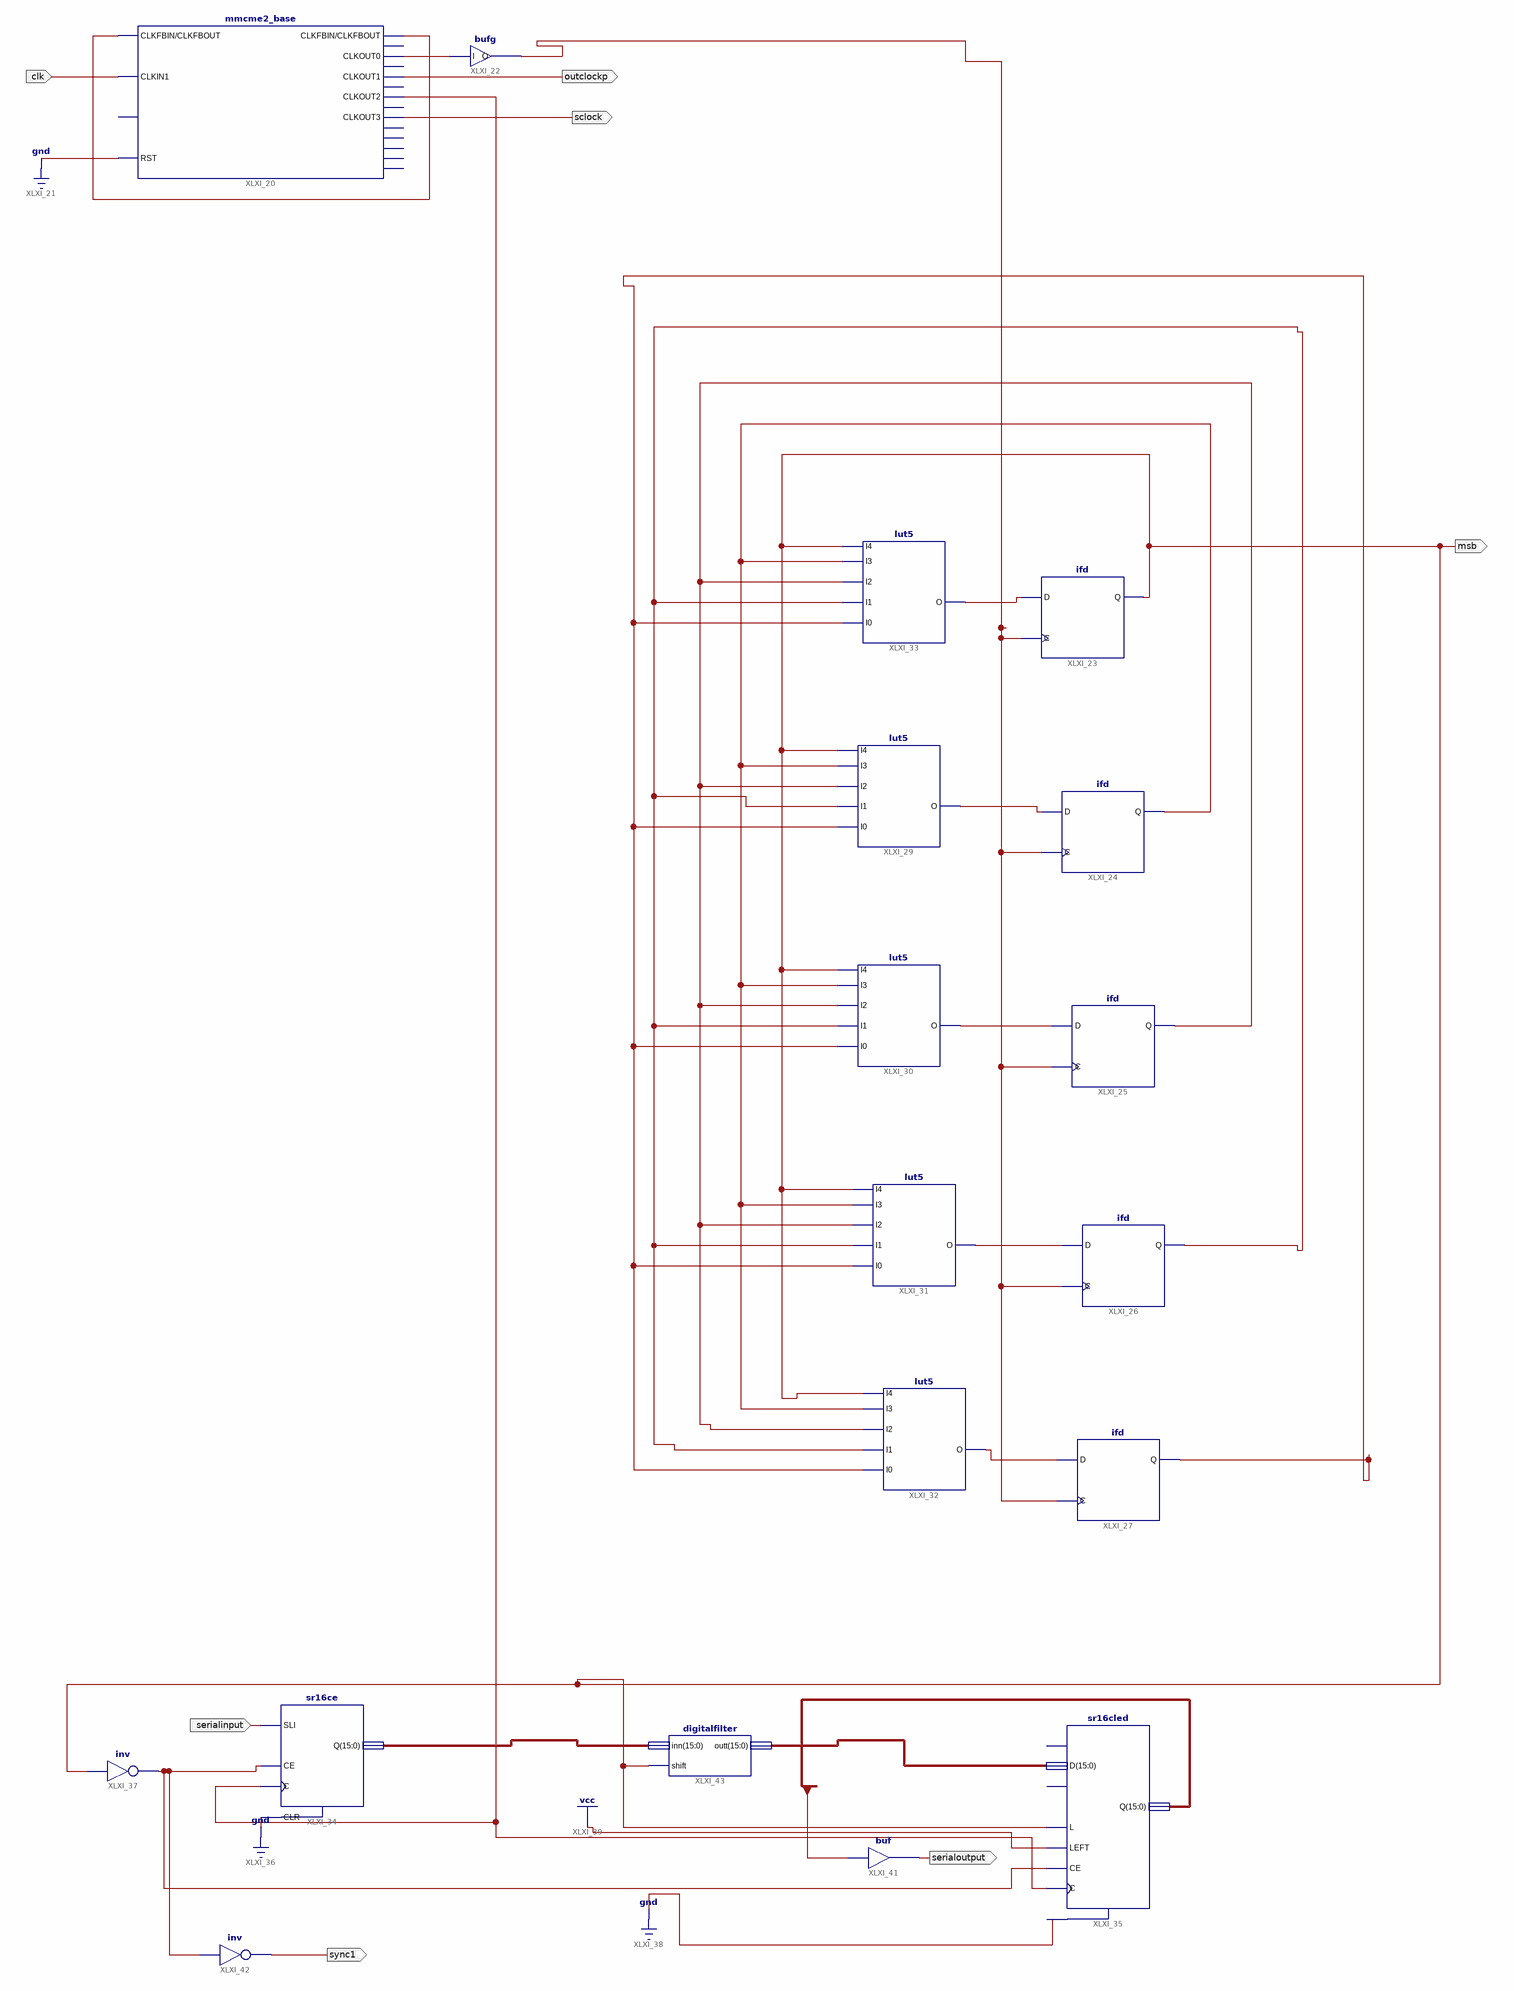
[diagram p0: schematic sheet 1]
// Xilinx ISE schematic timinggenerator.sch (artix7) as structural Verilog: 18 symbols, 7 ports
module timinggenerator (
  input  clk,
  input  serialinput,
  output outclockp,
  output msb,
  output serialoutput,
  output sclock,
  output sync1
);

  wire outclock, sync, XLXN_15, XLXN_19, XLXN_22, XLXN_23, XLXN_24, XLXN_25, XLXN_33, XLXN_36, XLXN_44,
       XLXN_48, XLXN_51, XLXN_54;
  wire [15:0] XLXN_69, XLXN_77, XLXN_79;

  mmcme2_base #(.CLKOUT0_DIVIDE_F(30), .CLKFBOUT_MULT_F(6.000), .CLKOUT1_PHASE(90), .CLKOUT1_DIVIDE(30), .CLKOUT2_PHASE(180), .CLKOUT2_DIVIDE(30), .CLKOUT3_PHASE(270), .CLKOUT3_DIVIDE(30)) XLXI_20 (
    .CLKFBIN(XLXN_15), .CLKIN1(clk), .RST(1'b0), .CLKFBOUT(XLXN_15), .CLKOUT0(XLXN_19), .CLKOUT1(outclockp),
    .CLKOUT2(XLXN_54), .CLKOUT3(sclock));  // open: PWRDWN, CLKFBOUTB, CLKOUT0B, CLKOUT1B, CLKOUT2B, CLKOUT3B, CLKOUT4, CLKOUT5, CLKOUT6, LOCKED
  bufg XLXI_22 (.I(XLXN_19), .O(outclock));
  ifd XLXI_23 (.C(outclock), .D(XLXN_51), .Q(msb));
  ifd XLXI_24 (.C(outclock), .D(XLXN_25), .Q(XLXN_33));
  ifd XLXI_25 (.C(outclock), .D(XLXN_24), .Q(XLXN_36));
  ifd XLXI_26 (.C(outclock), .D(XLXN_23), .Q(XLXN_48));
  lut5 #(.INIT("00007f80")) XLXI_29 (.I0(XLXN_44), .I1(XLXN_48), .I2(XLXN_36), .I3(XLXN_33), .O(XLXN_25), .I4(msb));
  lut5 #(.INIT("00007878")) XLXI_30 (.I0(XLXN_44), .I1(XLXN_48), .I2(XLXN_36), .I3(XLXN_33), .O(XLXN_24), .I4(msb));
  lut5 #(.INIT("00066666")) XLXI_31 (.I0(XLXN_44), .I1(XLXN_48), .I2(XLXN_36), .I3(XLXN_33), .O(XLXN_23), .I4(msb));
  lut5 #(.INIT("00055555")) XLXI_32 (.I0(XLXN_44), .I1(XLXN_48), .I2(XLXN_36), .I3(XLXN_33), .O(XLXN_22), .I4(msb));
  ifd XLXI_27 (.C(outclock), .D(XLXN_22), .Q(XLXN_44));
  lut5 #(.INIT("00078000")) XLXI_33 (.I0(XLXN_44), .I1(XLXN_48), .I2(XLXN_36), .I3(XLXN_33), .O(XLXN_51), .I4(msb));
  sr16ce XLXI_34 (.C(XLXN_54), .CE(sync), .CLR(1'b0), .SLI(serialinput), .Q(XLXN_77));
  sr16cled XLXI_35 (.C(XLXN_54), .CE(sync), .D(XLXN_79), .L(msb), .LEFT(1'b1), .Q(XLXN_69));  // open: CLR, SLI, SRI
  not XLXI_37 (sync, msb);
  buf XLXI_41 (serialoutput, XLXN_69[15]);
  not XLXI_42 (sync1, sync);
  digitalfilter XLXI_43 (.inn(XLXN_77), .outt(XLXN_79), .shift(msb));
endmodule
